# Altium schematic sheet PIC32MK.SchDoc
size B
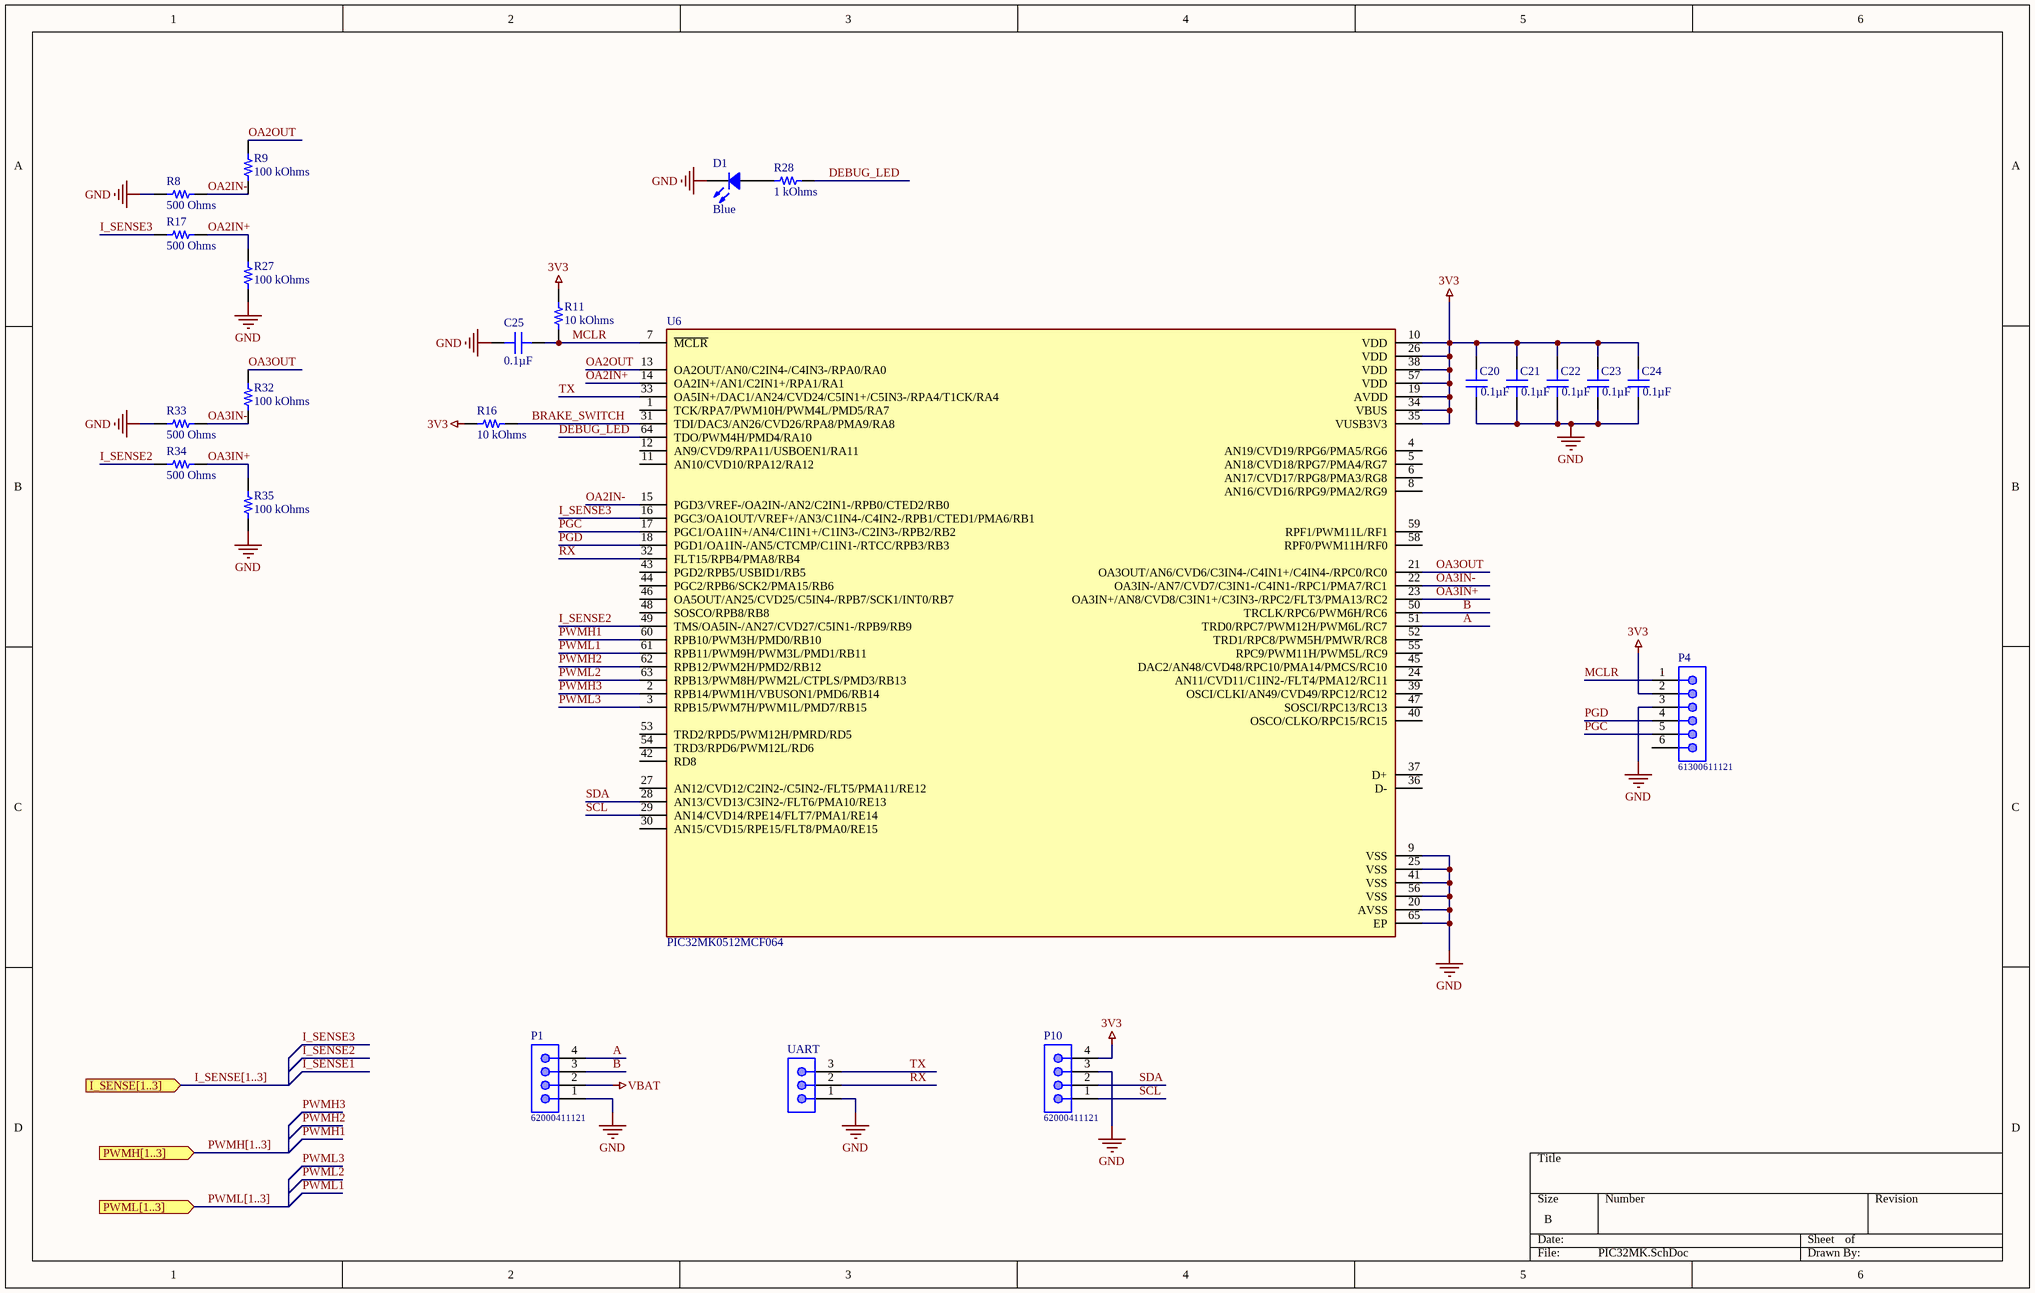
[diagram p0: PIC32MK.SchDoc]

## Parts
C20  0.1µF  [CAP 0603_1608]
C21  0.1µF  [CAP 0603_1608]
C22  0.1µF  [CAP 0603_1608]
C23  0.1µF  [CAP 0603_1608]
C24  0.1µF  [CAP 0603_1608]
C25  0.1µF  [CAP 0603_1608]
D1  Blue  [LED 0603_1608 GREEN]
P1  62000411121  [62000411121]
P4  61300611121  [61300611121]
P10  62000411121  [62000411121]
R8  500 Ohms  [RES 0603_1608]
R9  100 kOhms  [RES 0603_1608]
R11  10 kOhms  [RES 0603_1608]
R16  10 kOhms  [RES 0603_1608]
R17  500 Ohms  [RES 0603_1608]
R27  100 kOhms  [RES 0603_1608]
R28  1 kOhms  [RES 0603_1608]
R32  100 kOhms  [RES 0603_1608]
R33  500 Ohms  [RES 0603_1608]
R34  500 Ohms  [RES 0603_1608]
R35  100 kOhms  [RES 0603_1608]
U6  PIC32MK0512MCF064  [QFN50P900X900X100-65N]
UART  3 pin 2mm JST Male  [3pin - 2mm header]  (value not drawn)

## Ports
I_SENSE[1..3] (in), PWMH[1..3] (in), PWML[1..3] (in)

## Nets
3V3: C20.1 C21.1 C22.1 C23.1 C24.1 P4.2 P10.4 R11.2 R16.2 U6.10(VDD) U6.19(AVDD) U6.26(VDD) U6.34(VBUS) U6.35(VUSB3V3) U6.38(VDD) U6.57(VDD)
GND: C20.2 C21.2 C22.2 C23.2 C24.2 C25.2 D1.2 P1.1 P4.3 P10.3 R8.1 R27.1 R33.1 R35.1 U6.9(VSS) U6.20(AVSS) U6.25(VSS) U6.41(VSS) U6.56(VSS) U6.65(EP) UART.1
VBAT: P1.2
A: P1.4 U6.51(TRD0/RPC7/PWM12H/PWM6L/RC7)
B: P1.3 U6.50(TRCLK/RPC6/PWM6H/RC6)
BRAKE_SWITCH: R16.1 U6.31(TDI/DAC3/AN26/CVD26/RPA8/PMA9/RA8)
DEBUG_LED: R28.1 U6.64(TDO/PWM4H/PMD4/RA10)
I_SENSE2: R34.1 U6.49(TMS/OA5IN-/AN27/CVD27/C5IN1-/RPB9/RB9)
I_SENSE3: R17.1 U6.16(PGC3/OA1OUT/VREF+/AN3/C1IN4-/C4IN2-/RPB1/CTED1/PMA6/RB1)
MCLR: C25.1 P4.1 R11.1 U6.7(~{MCLR})
OA2IN+: R17.2 R27.2 U6.14(OA2IN+/AN1/C2IN1+/RPA1/RA1)
OA2IN-: R8.2 R9.1 U6.15(PGD3/VREF-/OA2IN-/AN2/C2IN1-/RPB0/CTED2/RB0)
OA2OUT: R9.2 U6.13(OA2OUT/AN0/C2IN4-/C4IN3-/RPA0/RA0)
OA3IN+: R34.2 R35.2 U6.23(OA3IN+/AN8/CVD8/C3IN1+/C3IN3-/RPC2/FLT3/PMA13/RC2)
OA3IN-: R32.1 R33.2 U6.22(OA3IN-/AN7/CVD7/C3IN1-/C4IN1-/RPC1/PMA7/RC1)
OA3OUT: R32.2 U6.21(OA3OUT/AN6/CVD6/C3IN4-/C4IN1+/C4IN4-/RPC0/RC0)
PGC: P4.5 U6.17(PGC1/OA1IN+/AN4/C1IN1+/C1IN3-/C2IN3-/RPB2/RB2)
PGD: P4.4 U6.18(PGD1/OA1IN-/AN5/CTCMP/C1IN1-/RTCC/RPB3/RB3)
PWMH1: U6.60(RPB10/PWM3H/PMD0/RB10)
PWMH2: U6.62(RPB12/PWM2H/PMD2/RB12)
PWMH3: U6.2(RPB14/PWM1H/VBUSON1/PMD6/RB14)
PWML1: U6.61(RPB11/PWM9H/PWM3L/PMD1/RB11)
PWML2: U6.63(RPB13/PWM8H/PWM2L/CTPLS/PMD3/RB13)
PWML3: U6.3(RPB15/PWM7H/PWM1L/PMD7/RB15)
RX: U6.32(FLT15/RPB4/PMA8/RB4) UART.2
SCL: P10.1 U6.29(AN14/CVD14/RPE14/FLT7/PMA1/RE14)
SDA: P10.2 U6.28(AN13/CVD13/C3IN2-/FLT6/PMA10/RE13)
TX: U6.33(OA5IN+/DAC1/AN24/CVD24/C5IN1+/C5IN3-/RPA4/T1CK/RA4) UART.3
NetD1_1: D1.1 R28.2

Not connected (* = marked no-connect by the designer): P4 6; U6 1(TCK/RPA7/PWM10H/PWM4L/PMD5/RA7) 4(AN19/CVD19/RPG6/PMA5/RG6) 5(AN18/CVD18/RPG7/PMA4/RG7) 6(AN17/CVD17/RPG8/PMA3/RG8) 8(AN16/CVD16/RPG9/PMA2/RG9) 11(AN10/CVD10/RPA12/RA12) 12(AN9/CVD9/RPA11/USBOEN1/RA11) 24(AN11/CVD11/C1IN2-/FLT4/PMA12/RC11) 27(AN12/CVD12/C2IN2-/C5IN2-/FLT5/PMA11/RE12) 30(AN15/CVD15/RPE15/FLT8/PMA0/RE15) 36(D-) 37(D+) 39(OSCI/CLKI/AN49/CVD49/RPC12/RC12) 40(OSCO/CLKO/RPC15/RC15) 42(RD8) 43(PGD2/RPB5/USBID1/RB5) 44(PGC2/RPB6/SCK2/PMA15/RB6) 45(DAC2/AN48/CVD48/RPC10/PMA14/PMCS/RC10) 46(OA5OUT/AN25/CVD25/C5IN4-/RPB7/SCK1/INT0/RB7) 47(SOSCI/RPC13/RC13) 48(SOSCO/RPB8/RB8) 52(TRD1/RPC8/PWM5H/PMWR/RC8) 53(TRD2/RPD5/PWM12H/PMRD/RD5) 54(TRD3/RPD6/PWM12L/RD6) 55(RPC9/PWM11H/PWM5L/RC9) 58(RPF0/PWM11H/RF0) 59(RPF1/PWM11L/RF1)

## Buses and harness runs
bus I_SENSE[1..3] = port I_SENSE[1..3]
bus PWMH[1..3] = port PWMH[1..3]
bus PWML[1..3] = port PWML[1..3]

## Library data of the parts
C20-C25 = GCG188R92A104KA03D: CAP CER 0.1UF 100V 0603 EPOXY; Manufacturer: Murata Electronics; Temperature Coefficient: X8R; Tolerance: ±10%; Part Number: GCG188R92A104KA03D; Value: 0.1µF; Applications: Automotive; Capacitance: 0.1µF; ComponentLink1Description: Datasheet; ComponentLink1URL: https://search.murata.co.jp/Ceramy/image/img/A01X/G101/ENG/GCG188R92A104KA03-01.pdf; ComponentLink2Description: DigiKey Link; ComponentLink2URL: http://digikey.com/product-detail/en/murata-electronics/GCG188R92A104KA03D/490-18197-1-ND/9867926; Device Package: 0603 (1608 Metric); Features: Epoxy Mountable; LastUpdated: 21-Jan-20 12:01:59 AM; Lifecycle Status: Active; Minimum Order: 1; Mounting Type: Surface Mount, MLCC, Epoxy; Operating Temperature: -55°C ~ 150°C; Package / Case: 0603 (1608 Metric); Packaging: TapeAndReel; PartId: 9025; Part Status: Active; Price: 0.07; Ratings: AEC-Q200; Series: GCG; Size / Dimension: 0.063" L x 0.031" W (1.60mm x 0.80mm); Supplier 1: DigiKey; Supplier Part Number 1: 490-18197-1-ND; Thickness (Max): 0.035" (0.90mm); Voltage - Rated: 100V
D1 = XZCDGK53W-8VF: Blue LED; Manufacturer: SunLED; Color: Green; Configuration: Independent; Current - Test: 2mA; Lens Color: Colorless; Lens Size: 0.35mm Dia; Lens Style: Round with Domed Top; Lens Transparency: Clear; Millicandela Rating: 417mcd; Value: Green; Viewing Angle: 60°; Voltage - Forward (Vf) (Typ): 2.65V; Wavelength - Dominant: 525nm; Wavelength - Peak: 515nm; Part Number: XZCDGK53W-8VF; ComponentLink1Description: Datasheet; ComponentLink1URL: https://www.sunledusa.com/products/spec/XZCDGK53W-8VF.pdf; ComponentLink2Description: DigiKey Link; ComponentLink2URL: http://digikey.com/product-detail/en/sunled/XZCDGK53W-8VF/1497-XZCDGK53W-8VFCT-ND/10449792; Device Package: 0603 (1608 Metric); Height (Max): 1.10mm; LastUpdated: 21-Jan-20 3:12:09 AM; Lifecycle Status: Active; Minimum Order: 1; Mounting Type: Surface Mount; Package / Case: 0603 (1608 Metric); Packaging: Unknown; PartId: 938; Part Status: Active; Price: 0.18; Series: Ultra Low Current; Size / Dimension: 1.60mm L x 0.80mm W; Supplier 1: DigiKey; Supplier Part Number 1: 1497-XZCDGK53W-8VFCT-ND; Supplier Device Package: 2-SMD
P1 P10 = 62000411121: WR-PHD Pin Header, THT, pitch 2mm, Single Row, Vertical, 4p; Manufacturer: Wurth Elektronik; Pin Number: 4; Rated Current: 2A; Working Voltage: 200VAC; Withstanding Voltage: 500VAC; Contact Resistance: 20mOhm; ComponentLink1Description: Manufacturer; ComponentLink1URL: http://www.we-online.de; ComponentLink2Description: Datasheet; ComponentLink2URL: https://www.we-online.com/catalog/datasheet/62000411121.pdf; Operating Temperature: -40 to +105degC; Published Date: May 2020; Pitch: 2mm; Manufacturer Part Number: 62000411121; Mounting Technology: THT; Packaging: Bag; Gender: Pin Header; Row Number: Single; Orientation: Vertical
P4 = 61300611121: WR-PHD Pin Header, THT, pitch 2.54mm, Single Row, Vertical, 6p; Manufacturer: Wurth Elektronik; Pin Number: 6; Rated Current: 3A; Working Voltage: 250VAC; Withstanding Voltage: 500VAC; Contact Resistance: 20mOhm; ComponentLink1Description: Manufacturer; ComponentLink1URL: http://www.we-online.de; ComponentLink2Description: Datasheet; ComponentLink2URL: https://www.we-online.com/catalog/datasheet/61300611121.pdf; Manufacturer Part Number: 61300611121; Published Date: May 2020; Pitch: 2.54mm; Operating Temperature: -40 to +105degC; Mounting Technology: THT; Packaging: Bag; Gender: Pin Header; Row Number: Single; Orientation: Vertical
R8 R17 R33 R34 = TNPU0603500RAZEN00: RES SMD 500 OHM 0.05% 1/10W 0603; Manufacturer: Vishay Dale; Power (Watts): 0.1W, 1/10W; Temperature Coefficient: ±5ppm/°C; Part Number: TNPU0603500RAZEN00; Value: 500 Ohms; ComponentLink1Description: Datasheet; ComponentLink1URL: http://www.vishay.com/docs/28779/tnpue3.pdf; ComponentLink2Description: DigiKey Link; ComponentLink2URL: http://digikey.com/product-detail/en/vishay-dale/TNPU0603500RAZEN00/541-3301-1-ND/6615958; Composition: Thin Film; Device Package: 0603 (1608 Metric); Features: Anti-Sulfur, Automotive AEC-Q200, Moisture Resistant; Height - Seated (Max): 0.022" (0.55mm); LastUpdated: 13-Aug-20 10:37:00 AM; Lifecycle Status: Active; Minimum Order: 1; Number of Terminations: 2; Operating Temperature: -55°C ~ 125°C; Package / Case: 0603 (1608 Metric); Packaging: TapeAndReel; PartId: 11840; Part Status: Active; Price: 1.20; Ratings: AEC-Q200; Resistance: 500 Ohms; Series: TNPU; Size / Dimension: 0.063" L x 0.033" W (1.60mm x 0.85mm); Supplier 1: DigiKey; Supplier Part Number 1: 541-3301-1-ND; Supplier Device Package: 0603; Tolerance: ±0.05%
R9 R27 R32 R35 = RCA0603100KFKEAHP: RES SMD 100K OHM 1% 1/4W 0603; Manufacturer: Vishay Dale; Power (Watts): 0.25W, 1/4W; Temperature Coefficient: ±100ppm/°C; Part Number: RCA0603100KFKEAHP; Value: 100 kOhms; ComponentLink1Description: Datasheet; ComponentLink1URL: http://www.vishay.com/docs/20067/rcahp.pdf; ComponentLink2Description: DigiKey Link; ComponentLink2URL: http://digikey.com/product-detail/en/vishay-dale/RCA0603100KFKEAHP/541-3247-1-ND/6561261; Composition: Thick Film; Device Package: 0603 (1608 Metric); Features: Anti-Sulfur, Automotive AEC-Q200, Pulse Withstanding; Height - Seated (Max): 0.022" (0.55mm); LastUpdated: 13-Aug-20 10:36:33 AM; Lifecycle Status: Active; Minimum Order: 1; Number of Terminations: 2; Operating Temperature: -55°C ~ 155°C; Package / Case: 0603 (1608 Metric); Packaging: TapeAndReel; PartId: 24371; Part Status: Active; Price: 0.03; Ratings: AEC-Q200; Resistance: 100 kOhms; Series: RCA-HP; Size / Dimension: 0.063" L x 0.033" W (1.60mm x 0.85mm); Supplier 1: DigiKey; Supplier Part Number 1: 541-3247-1-ND; Supplier Device Package: 0603; Tolerance: ±1%
R11 R16 = RNCS0603BKE10K0: RES 10K OHM 0.1% 1/16W 0603; Manufacturer: Stackpole Electronics Inc; Power (Watts): 0.063W, 1/16W; Temperature Coefficient: ±25ppm/°C; Part Number: RNCS0603BKE10K0; Value: 10 kOhms; ComponentLink1Description: Datasheet; ComponentLink1URL: https://www.seielect.com/catalog/sei-rncs_rnch.pdf; ComponentLink2Description: DigiKey Link; ComponentLink2URL: http://digikey.com/product-detail/en/stackpole-electronics-inc/RNCS0603BKE10K0/RNCS0603BKE10K0CT-ND/1800113; Composition: Thin Film; Device Package: 0603 (1608 Metric); Features: Anti-Corrosive, Automotive AEC-Q200, Moisture Resistant; Height - Seated (Max): 0.022" (0.55mm); LastUpdated: 21-Jan-20 12:25:01 AM; Lifecycle Status: Active; Minimum Order: 1; Number of Terminations: 2; Operating Temperature: -55°C ~ 155°C; Package / Case: 0603 (1608 Metric); Packaging: TapeAndReel; PartId: 4838; Part Status: Active; Price: 0.08; Ratings: AEC-Q200; Resistance: 10 kOhms; Series: RNCS; Size / Dimension: 0.061" L x 0.031" W (1.55mm x 0.80mm); Supplier 1: DigiKey; Supplier Part Number 1: RNCS0603BKE10K0CT-ND; Supplier Device Package: 0603; Tolerance: ±0.1%
R28 = RNCF0603DTE1K00: RES 1K OHM 0.5% 1/10W 0603; Manufacturer: Stackpole Electronics Inc; Power (Watts): 0.1W, 1/10W; Temperature Coefficient: ±25ppm/°C; Part Number: RNCF0603DTE1K00; Value: 1 kOhms; ComponentLink1Description: Datasheet; ComponentLink1URL: https://www.seielect.com/catalog/sei-rncf.pdf; ComponentLink2Description: DigiKey Link; ComponentLink2URL: http://digikey.com/product-detail/en/stackpole-electronics-inc/RNCF0603DTE1K00/RNCF0603DTE1K00CT-ND/9915086; Composition: Thin Film; Device Package: 0603 (1608 Metric); Features: Automotive AEC-Q200; Height - Seated (Max): 0.022" (0.55mm); LastUpdated: 21-Jan-20 12:14:28 AM; Lifecycle Status: Active; Minimum Order: 1; Number of Terminations: 2; Operating Temperature: -55°C ~ 155°C; Package / Case: 0603 (1608 Metric); Packaging: TapeAndReel; PartId: 26300; Part Status: Active; Price: 0.05; Ratings: AEC-Q200; Resistance: 1 kOhms; Series: RNCF; Size / Dimension: 0.061" L x 0.031" W (1.55mm x 0.80mm); Supplier 1: DigiKey; Supplier Part Number 1: RNCF0603DTE1K00CT-ND; Supplier Device Package: 0603; Tolerance: ±0.5%
U6 = PIC32MK0512MCF064: PIC32MK Microcontroller IC 32-Bit 120MHz 1MB _1M x 8_ FLASH 64-TQFP _10x10_; MP: PIC32MK1024MCF064-I/PT; MF: Microchip; Digi-Key_Purchase_URL: https://www.digikey.kr/product-detail/en/microchip-technology/PIC32MK1024MCF064-I-PT/PIC32MK1024MCF064-I-PT-ND/7164902?utm_source=snapeda&utm_medium=aggregator&utm_campaign=symbol; Package: TQFP-64 Microchip; Digi-Key_Part_Number: PIC32MK1024MCF064-I/PT-ND; Value: *; SnapEDA_Link: https://www.snapeda.com/parts/PIC32MK1024MCF064-I/PT/Microchip/view-part/876704/?ref=snap